# EAGLE design IR_Sensor (EAGLE 9.6.2)
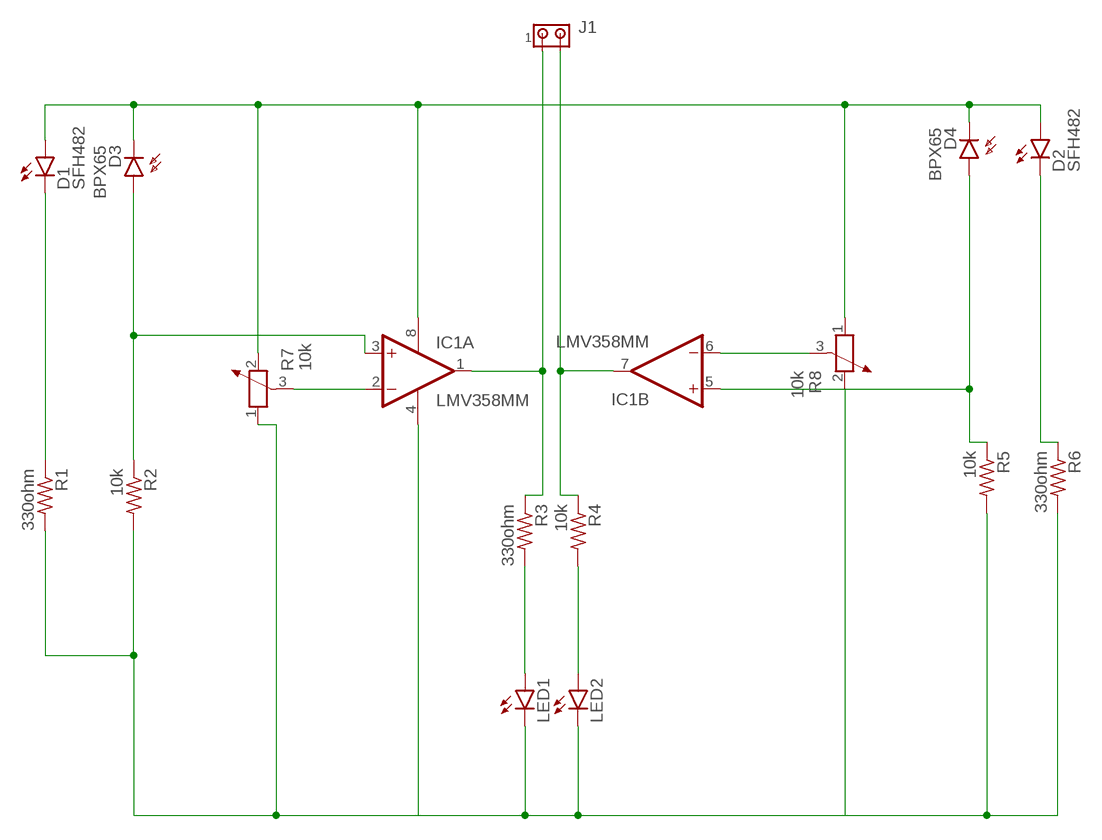
[diagram p0: schematic, sheet 1]

## Parts
D1  SFH482  [SFH482]
D2  SFH482  [SFH482]
D3  BPX65  [BPX65]
D4  BPX65  [BPX65]
IC1  LMV358MM  [MSOP08]
J1  MTA02-100  [10X02MTA]
LED1  LED3MM  [LED3MM]
LED2  LED3MM  [LED3MM]
R1  330ohm  R-US_0207/10  [0207/10]
R2  10k  R-US_0207/10  [0207/10]
R3  330ohm  R-US_0207/10  [0207/10]
R4  10k  R-US_0207/10  [0207/10]
R5  10k  R-US_0207/10  [0207/10]
R6  330ohm  R-US_0207/10  [0207/10]
R7  10k  POTENTIOMETER_PT-10  [PT-10]
R8  10k  POTENTIOMETER_PT-10  [PT-10]

## Nets
N$1: D1.A D2.A D3.K(C) D4.K(C) IC1.8(P:V+) R7.2 R8.1
N$2: IC1.4(P:V-) LED1.K(C) LED2.K(C) R1.2 R2.2 R5.2 R6.2 R7.1 R8.2
N$3: LED1.A R3.2
N$4: LED2.A R4.2
N$5: IC1.1(A:OUT) J1.1 R3.1
N$6: IC1.7(B:OUT) J1.2 R4.1
N$7: IC1.6(B:-IN) R8.3
N$8: D1.K(C) R1.1
N$9: D3.A IC1.3(A:+IN) R2.1
N$10: D4.A IC1.5(B:+IN) R5.1
N$11: D2.K(C) R6.1
N$12: IC1.2(A:-IN) R7.3

## Library data of the parts
D1 D2 = led:SFH482: IR LED infrared emitting diode, Infineon
D3 D4 = opto-trans-siemens:BPX65: PHOTO DIODE; MPN: BPX65.; OC_FARNELL: 327451; OC_NEWARK: 06WX2764
IC1 = linear:LMV358?*: Dual General Purpose, Low Voltage, Rail-to-Rail Output Operational Amplifiers Source: http://www.national.com/mpf/LM/LMV321.html http://www.national.com/dt/lmv_qual.pdf
J1 = con-amp:MTA02-100: AMP connector
LED1 LED2 = led:LED: LED OSRAM: - CHIPLED LG R971, LG N971, LY N971, LG Q971, LY Q971, LO R971, LY R971 LH N974, LH R974 LS Q976, LO Q976, LY Q976 LO Q996 - Hyper CHIPLED LW Q18S LB Q993, LB Q99A, LB R99A - SideLED LS A670, LO A670, LY A670, LG A670, LP A670 LB A673, LV A673, LT A673, LW A673 LH A674 LY A675 LS A676, LA A676, LO A676, LY A676, LW A676 LS A679, LY A679, LG A679 - Hyper Micro SIDELED® LS Y876, LA Y876, LO Y876, LY Y876 LT Y87S - SmartLED LW L88C, LW L88S LB L89C, LB L89S, LG L890 LS L89K, LO L89K, LY L89K LS L896, LA L896, LO L896, LY L896 - TOPLED LS T670, LO T670, LY T670, LG T670, LP T670 LSG T670, LSP T670, LSY T670, LOP T670, LYG T670 LG T671, LOG T671, LSG T671 LB T673, LV T673, LT T673, LW T673 LH T674 LS T676, LA T676, LO T676, LY T676, LB T676, LH T676, LSB T676, LW T676 LB T67C, LV T67C, LT T67C, LS T67K, LO T67K, LY T67K, LW E67C LS E67B, LA E67B, LO E67B, LY E67B, LB E67C, LV E67C, LT E67C LW T67C LS T679, LY T679, LG T679 LS T770, LO T770, LY T770, LG T770, LP T770 LB T773, LV T773, LT T773, LW T773 LH T774 LS E675, LA E675, LY E675, LS T675 LS T776, LA T776, LO T776, LY T776, LB T776 LHGB T686 LT T68C, LB T68C - Hyper Mini TOPLED® LB M676 - Mini TOPLED Santana® LG M470 LS M47K, LO M47K, LY M47K Source: http://www.osram.convergy.de LUXEON: - LUMILED® LXK2-PW12-R00, LXK2-PW12-S00, LXK2-PW14-U00, LXK2-PW14-V00 LXK2-PM12-R00, LXK2-PM12-S00, LXK2-PM14-U00 LXK2-PE12-Q00, LXK2-PE12-R00, LXK2-PE12-S00, LXK2-PE14-T00, LXK2-PE14-U00 LXK2-PB12-K00, LXK2-PB12-L00, LXK2-PB12-M00, LXK2-PB14-N00, LXK2-PB14-P00, LXK2-PB14-Q00 LXK2-PR12-L00, LXK2-PR12-M00, LXK2-PR14-Q00, LXK2-PR14-R00 LXK2-PD12-Q00, LXK2-PD12-R00, LXK2-PD12-S00 LXK2-PH12-R00, LXK2-PH12-S00 LXK2-PL12-P00, LXK2-PL12-Q00, LXK2-PL12-R00 Source: www.luxeon.com KINGBRIGHT: KA-3528ASYC Source: www.kingbright.com
R1-R6 = rcl:R-US_: RESISTOR, American symbol; SPICEPREFIX: R
R7 R8 = rcl:POTENTIOMETER_: Potentiometer; SPICEMODEL: POT; SPICEPREFIX: X

## Board
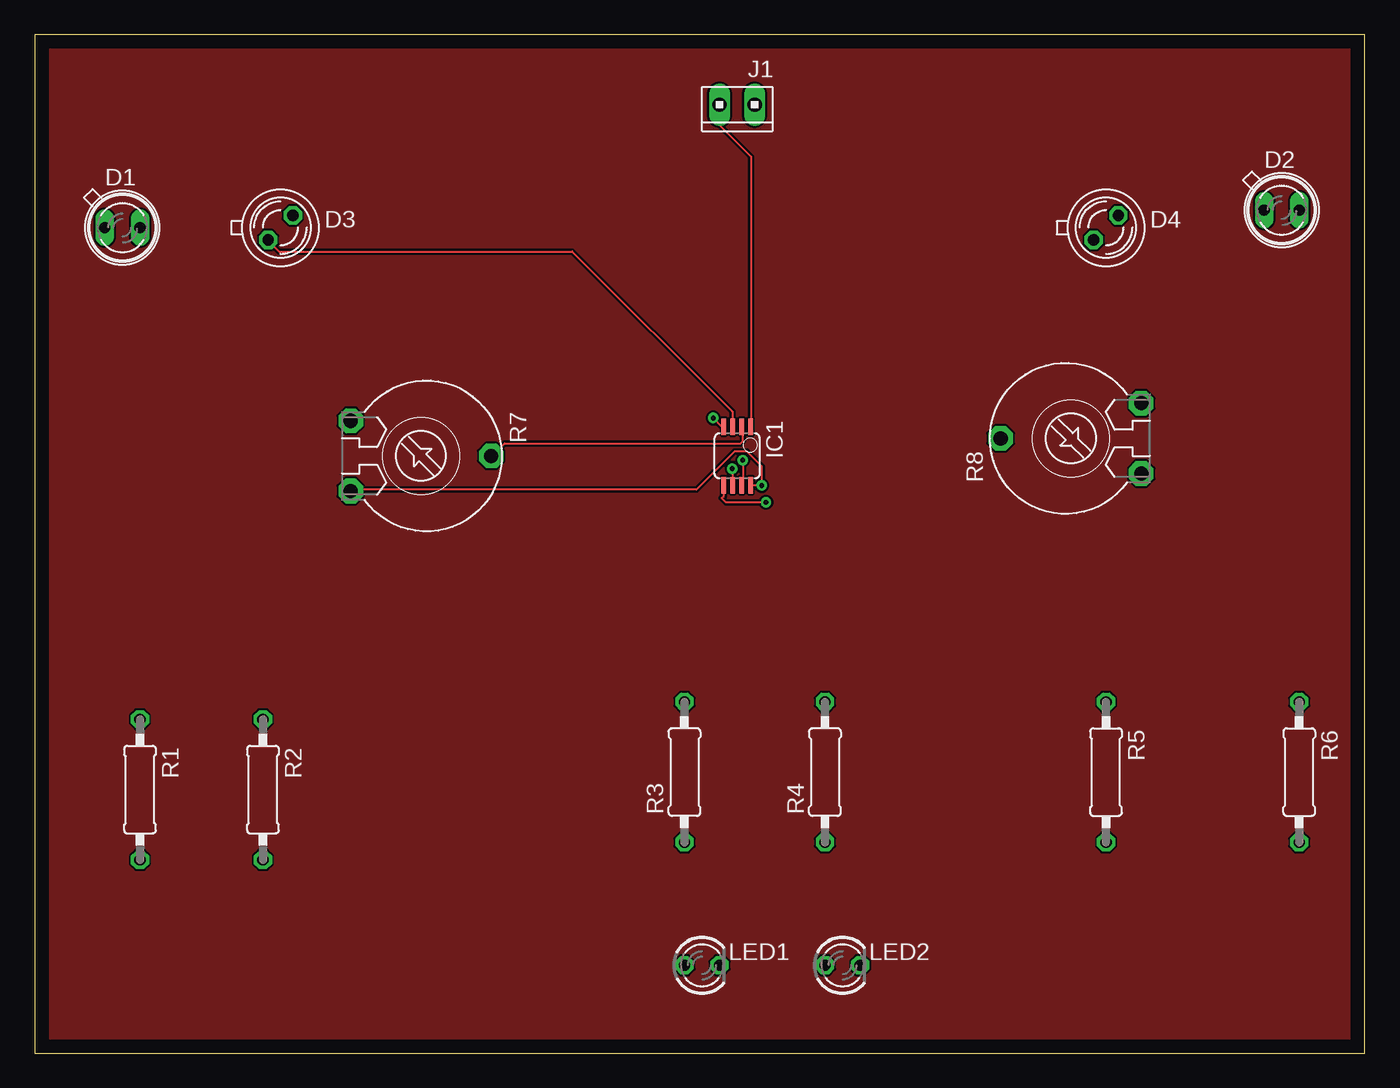
[diagram p1: board, top side]
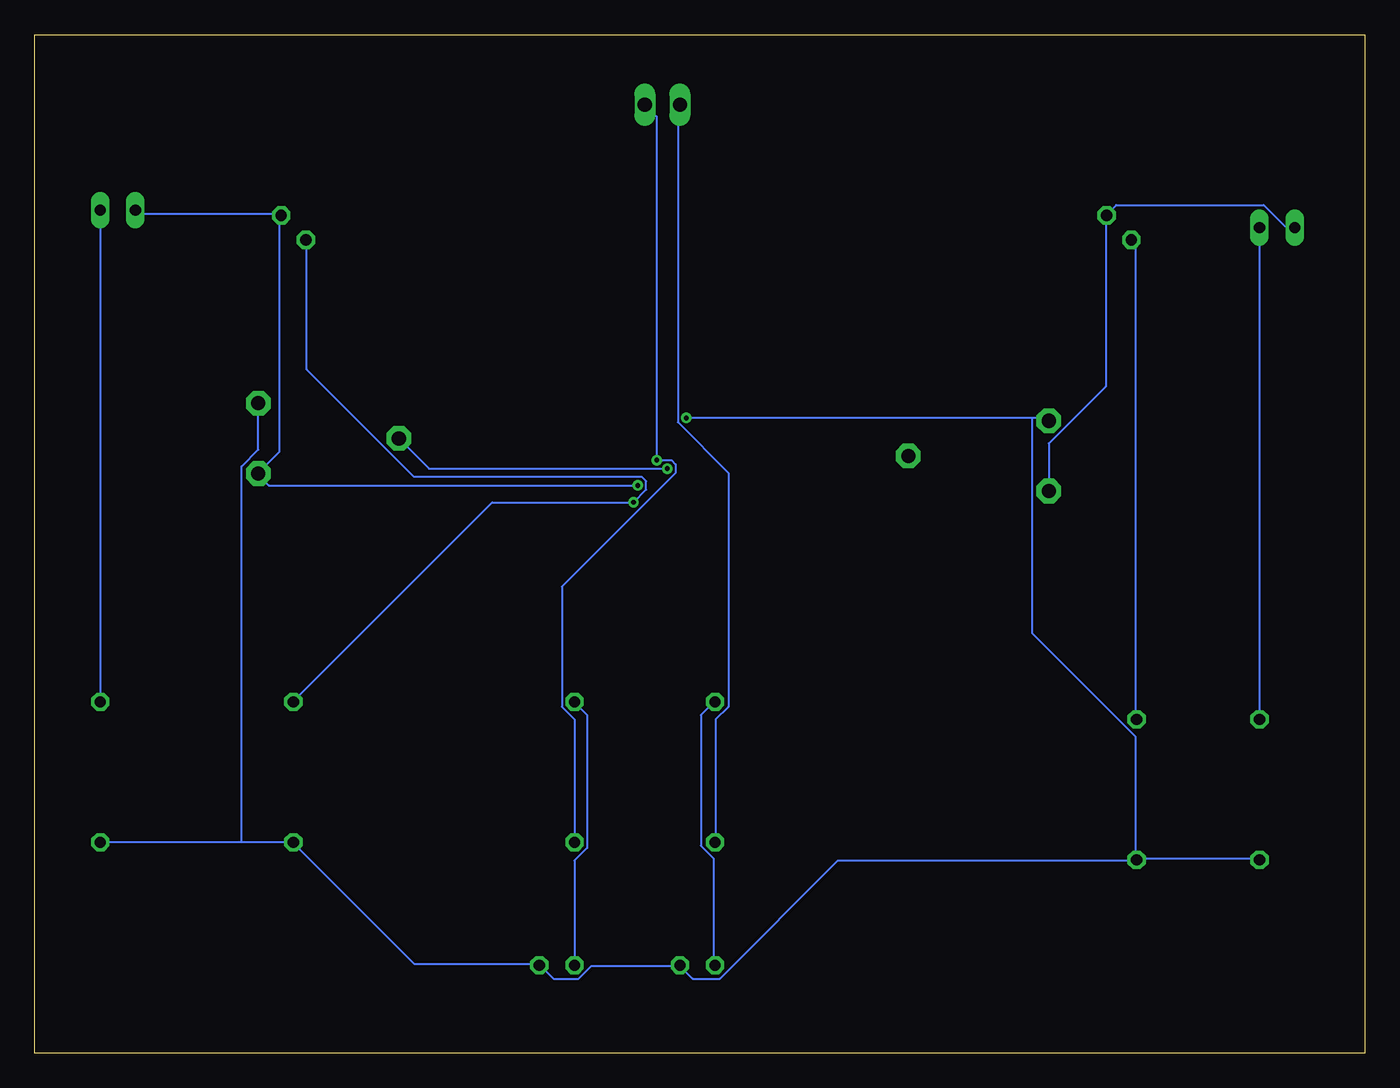
[diagram p2: board, bottom side, seen from below]

Size 96.19 x 73.65 mm. Coordinates in mm from the lower left corner, seen from the top.
Outline: 0,0 96.19,0 96.19,73.65 0,73.65 0,0
Copper layers (1*16): Top 0.035mm / dielectric 1.5mm / Bottom 0.035mm
Design rules "default": minimum track width 6mil, minimum drill 0.35mm, track to track 6mil, track to pad 6mil, pad to pad 6mil, via to via 6mil, smd to smd 6mil, copper to edge 40mil, drill to drill 6mil, minimum pad ring 10mil, minimum via ring 8mil, stop-mask expansion 4mil, vias tented up to drill 0mil, thermal gap 10mil

### Footprints (pad centres in the part's own frame; a part is rotated, then mirrored left to right if it is on the bottom)
SFH482 = drill 0.813 long: A -1.27,0; K 1.27,0
BPX65 = drill 0.813 octagon: A -0.889,-0.889; K 0.889,0.889
MSOP08 = smd 0.3 x 1.2: 1 -0.976,-2.113; 2 -0.326,-2.113; 3 0.324,-2.113; 4 0.974,-2.113; 5 0.974,2.112; 6 0.324,2.112; 7 -0.326,2.112; 8 -0.976,2.112
10X02MTA = drill 1.016 long: 1 1.27,0; 2 -1.27,0
LED3MM = drill 0.813 octagon: A -1.27,0; K 1.27,0
0207/10 = drill 0.813 octagon: 1 -5.08,0; 2 5.08,0
PT-10 = drill 1.016 pad 1.778 octagon: 1 -2.54,-5.08; 2 2.54,-5.08; 3 0,5.08

### Placement (x,y rotation side)
D1  6.35,59.69 0 top
D2  90.17,60.96 0 top
D3  17.78,59.69 0 top
D4  77.47,59.69 0 top
IC1  50.8,43.18 180 top
J1  50.8,68.58 180 top
LED1  48.26,6.35 0 top
LED2  58.42,6.35 0 top
R1  7.62,19.05 270 top
R2  16.51,19.05 270 top
R3  46.99,20.32 90 top
R4  57.15,20.32 90 top
R5  77.47,20.32 270 top
R6  91.44,20.32 270 top
R7  27.94,43.18 270 top
R8  74.93,44.45 90 top

### Tracks (layer width: path | path; a pad name or v marks a point on that pad's centre or on a via)
N$1  (via drill 0.35)
  Top 0.152: IC1.8 51.82,41.05 v52.58,41.05 52.58,42.42 51.51,43.48 50.6,43.48 47.85,40.74 22.86,40.74 R7.2
  Bottom 0.152: D1.A 5.18,59.79 5.79,59.79 7.31,61.32 17.98,61.32 18.59,60.71 D3.K 18.75,60.55 18.75,48.21 22.86,44.09 R7.2 | D2.A 88.85,60.86 88.7,60.71 78.49,60.71 D4.K 78.49,60.55 78.49,43.48 80.01,41.96 R8.1 80.01,41.81 79.25,41.05 v52.58,41.05
N$2  (via drill 0.35)
  Top 0.152: v49.07,45.92 49.68,45.31 IC1.4
  Bottom 0.152: R1.2 7.62,14.07 16.46,14.07 R2.2 | 24.08,45.92 23.01,45.92 22.86,45.77 R7.1 | 24.08,45.92 v49.07,45.92 | 24.08,45.92 24.08,30.38 16.61,22.91 16.61,14.07 R2.2 | 49.53,6.3 55.93,6.3 56.84,5.38 58.67,5.38 59.59,6.3 LED2.K 59.74,6.45 68.73,6.45 77.42,15.14 R5.2 77.57,15.29 81.23,15.29 | 81.23,15.29 91.44,15.29 R6.2 | R8.2 80.01,43.64 81.23,42.42 81.23,15.29 | 49.53,6.3 48.62,5.38 46.63,5.38 38.1,13.92 16.61,13.92 R2.2 | 49.53,6.3 LED1.K
N$3
  Bottom 0.152: LED1.A 47.09,6.45 47.09,14.07 48.01,14.99 48.01,24.44 47.09,25.35 R3.2
N$4
  Bottom 0.152: LED2.A 57.15,13.92 56.24,14.83 56.24,24.44 57.15,25.35 R4.2
N$5
  Top 0.152: J1.1 49.53,67.11 51.82,64.82 51.82,45.31 IC1.1
  Bottom 0.152: R3.1 46.94,15.29 46.94,24.13 46.02,25.04 46.02,41.96 49.68,45.62 49.68,68.33 49.53,68.48 J1.1
N$6  (via drill 0.35)
  Top 0.152: v51.21,42.88 51.21,41.2 IC1.7
  Bottom 0.152: J1.2 51.21,67.72 v51.21,42.88 50.14,42.88 49.84,42.57 49.84,41.96 58.06,33.73 58.06,25.04 57.15,24.13 R4.1
N$7  (via drill 0.35)
  Top 0.152: v50.44,42.27 50.44,41.2 IC1.6
  Bottom 0.152: v50.44,42.27 67.67,42.27 R8.3
N$8
  Bottom 0.152: D1.K R1.1
N$9
  Top 0.152: IC1.3 50.44,45.31 50.44,46.38 38.86,57.96 17.68,57.96 16.92,58.73 D3.A
  Bottom 0.152: R2.1 16.61,24.13 16.61,58.57 16.76,58.73 D3.A
N$10  (via drill 0.35)
  Top 0.152: v52.88,39.83 49.99,39.83 49.68,40.13 49.84,40.28 49.84,41.05 IC1.5
  Bottom 0.152: R5.1 77.42,25.5 63.09,39.83 v52.88,39.83 51.97,40.74 51.97,41.35 52.27,41.66 68.73,41.66 76.5,49.43 76.5,58.73 D4.A
N$11
  Bottom 0.152: D2.K R6.1
N$12
  Top 0.152: IC1.2 51.21,45.16 51.21,44.25 51.05,44.09 33.98,44.09 33.07,43.18 R7.3
N$13
  pour Top: 0,0 0,73.66 96.52,73.66 96.52,0